# EAGLE design SoundMeter1.1 (EAGLE 7.1.0)
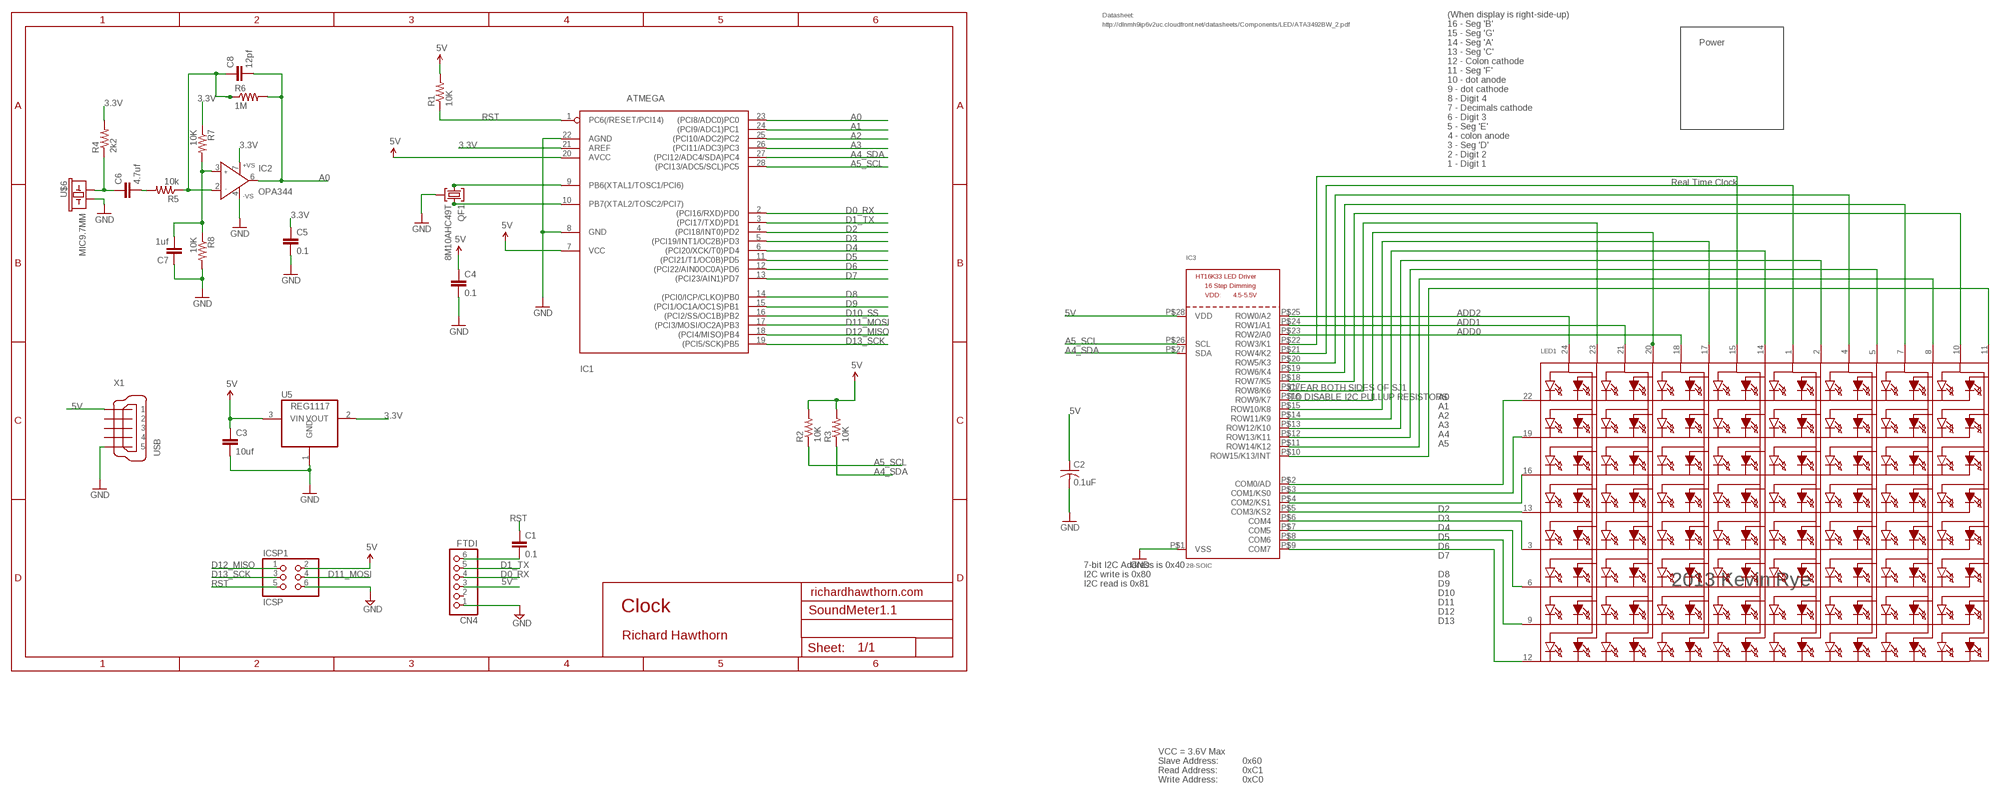
[diagram p0: schematic, sheet 1]

## Parts
C1  0.1  CAPPTH2  [CAP-PTH-SMALL2]
C2  0.1uF  C-US025-025X050  [C025-025X050]
C3  10uf  CAPPTH2  [CAP-PTH-SMALL2]
C4  0.1  CAPPTH2  [CAP-PTH-SMALL2]
C5  0.1  CAPPTH2  [CAP-PTH-SMALL2]
C6  4.7uf  CAPPTH2  [CAP-PTH-SMALL2]
C7  1uf  CAPPTH2  [CAP-PTH-SMALL2]
C8  12pf  CAPPTH2  [CAP-PTH-SMALL2]
CN4  FTDI  PINHD-1X6  [1X06]
IC1  ATMEGA  ATMEGA168PROUND  [DIL28-3-ROUND]
IC2  OPA344  [DIL08]
IC3  28-SOIC  HT16K33_SOP28  [SOP28_300MIL]
ICSP1  ICSP  PINHD-2X3  [2X03]
LED1  DISP_SEGMENT_8X8_BICOLOR_ROWCATHODEMI2A883XX  [SEGMENT_BICOL_BL-M12A883XX]
QF1  8M10AHC49T  [HC49U]
R1  10K  R-US_0204/7  [0204/7]
R2  10K  R-US_0204/7  [0204/7]
R3  10K  R-US_0204/7  [0204/7]
R4  2k2  R-US_0204/7  [0204/7]
R5  10k  R-US_0204/7  [0204/7]
R6  1M  R-US_0204/7  [0204/7]
R7  10K  R-US_0204/7  [0204/7]
R8  10K  R-US_0204/7  [0204/7]
U5  REG1117  [SOT223]
U$6  MIC9.7MM  [MIC-9.7MM]
X1  USB  MINI-USB_SHIELD5P2-32005-601  [32005-601]

## Nets
3.3V: C5.1 IC1.21(AREF) IC2.7(+VS) R4.2 R7.1 U5.2(VOUT)
5V: C2.1 C3.1 C4.1 CN4.3 IC1.7(VCC) IC1.20(AVCC) IC3.P$28(VDD) ICSP1.2 R1.2 R2.2 R3.2 U5.3(VIN) X1.1
A0: C8.2 IC1.23((PCI8/ADC0)PC0) IC2.6(OUT) R6.2
A1: IC1.24((PCI9/ADC1)PC1)
A2: IC1.25((PCI10/ADC2)PC2)
A3: IC1.26((PCI11/ADC3)PC3)
A4_SDA: IC1.27((PCI12/ADC4/SDA)PC4) IC3.P$27(SDA) R3.1
A5_SCL: IC1.28((PCI13/ADC5/SCL)PC5) IC3.P$26(SCL) R2.1
ADD0: IC3.P$23(ROW2/A0) LED1.18(A5)
ADD1: IC3.P$24(ROW1/A1) LED1.21(A3)
ADD2: IC3.P$25(ROW0/A2) LED1.24(A1)
COM: IC3.P$2(COM0/AD) LED1.22(K1)
D0_RX: CN4.4 IC1.2((PCI16/RXD)PD0)
D1_TX: CN4.5 IC1.3((PCI17/TXD)PD1)
D2: IC1.4((PCI18/INT0)PD2)
D3: IC1.5((PCI19/INT1/OC2B)PD3)
D4: IC1.6((PCI20/XCK/T0)PD4)
D5: IC1.11((PCI21/T1/OC0B)PD5)
D6: IC1.12((PCI22/AIN0OC0A)PD6)
D7: IC1.13((PCI23/AIN1)PD7)
D8: IC1.14((PCI0/ICP/CLKO)PB0)
D9: IC1.15((PCI1/OC1A/OC1S)PB1)
D10_SS: IC1.16((PCI2/SS/OC1B)PB2)
D11_MOSI: IC1.17((PCI3/MOSI/OC2A)PB3) ICSP1.4
D12_MISO: IC1.18((PCI4/MISO)PB4) ICSP1.1
D13_SCK: IC1.19((PCI5/SCK)PB5) ICSP1.3
GND [power]: C2.2 C3.2 C4.2 C5.2 C7.1 CN4.1 IC1.8(GND) IC1.22(AGND) IC2.4(-VS) IC3.P$1(VSS) ICSP1.6 QF1.2 R8.2 U5.1(GND) U$6.2 X1.5
N$1: C6.2 R5.2
N$2: IC3.P$9(COM7) LED1.12(K8)
N$3: C8.1 IC2.2(IN-) R5.1 R6.1
N$4: IC3.P$8(COM6) LED1.9(K7)
N$5: C6.1 R4.1 U$6.1
N$6: C7.2 IC2.3(IN+) R7.2 R8.1
N$7: IC3.P$7(COM5) LED1.6(K6)
N$8: IC3.P$6(COM4) LED1.3(K5)
N$9: IC3.P$5(COM3/KS2) LED1.13(K4)
N$10: IC3.P$4(COM2/KS1) LED1.16(K3)
N$11: IC3.P$3(COM1/KS0) LED1.19(K2)
N$14: IC3.P$11(ROW14/K12) LED1.8(A14)
N$15: IC3.P$12(ROW13/K11) LED1.5(A12)
N$16: IC1.9(PB6(XTAL1/TOSC1/PCI6)) QF1.1
N$20: C1.2 CN4.6
N$21: IC3.P$18(ROW7/K5) LED1.10(A15)
N$23: IC3.P$19(ROW6/K4) LED1.7(A13)
N$26: IC1.10(PB7(XTAL2/TOSC2/PCI7)) QF1.3
N$27: IC3.P$21(ROW4/K2) LED1.1(A9)
N$28: IC3.P$22(ROW3/K1) LED1.15(A7)
N$31: IC3.P$10(ROW15/K13/INT) LED1.11(A16)
N$35: IC3.P$20(ROW5/K3) LED1.4(A11)
N$38: IC3.P$17(ROW8/K6) LED1.23(A2)
N$39: IC3.P$16(ROW9/K7) LED1.20(A4)
N$40: IC3.P$14(ROW11/K9) LED1.14(A8)
N$41: IC3.P$15(ROW10/K8) LED1.17(A6)
N$42: IC3.P$13(ROW12/K10) LED1.2(A10)
RST: C1.1 IC1.1(PC6(/RESET/PCI14)) ICSP1.5 R1.1
Unconnected: CN4.2 X1.2 X1.3 X1.4 X1.M1(S1) X1.M2(S2)

## Notes on the sheet
- Datasheet: | (When display is right-side-up)
- http://dlnmh9ip6v2uc.cloudfront.net/datasheets/Components/LED/ATA3492BW_2.pdf | 16 - Seg 'B'
- 15 - Seg 'G'
- 14 - Seg 'A' | Power
- 13 - Seg 'C'
- 12 - Colon cathode
- 11 - Seg 'F'
- 10 - dot anode
- 9 - dot cathode
- 8 - Digit 4
- 7 - Decimals cathode
- 6 - Digit 3
- 5 - Seg 'E'
- 4 - colon anode
- 3 - Seg 'D'
- 2 - Digit 2
- 1 - Digit 1
- Real Time Clock
- CLEAR BOTH SIDES OF SJ1
- TO DISABLE I2C PULLUP RESISTORS | A0
- A1
- A2
- A3
- A4
- A5
- D2
- D3
- D4
- D5
- D6
- D7
- 7-bit I2C Address is 0x40
- I2C write is 0x80 | D8
- I2C read is 0x81 | D9 | 2013 Kevin Rye
- richardhawthorn.com | D10
- D11
- Clock | D12
- D13
- Richard Hawthorn
- VCC = 3.6V Max
- Slave Address: | 0x60
- Read Address: | 0xC1
- Write Address: | 0xC0

## Library data of the parts
C1 C3-C8 = LowPowerLab:CAP: Capacitor Standard 0603 ceramic capacitor, and 0.1" leaded capacitor.
C2 = adafruit:C-US: CAPACITOR, American symbol
CN4 = pinhead:PINHD-1X6: PIN HEADER
IC1 = adafruit:ATMEGA168*P: MICROCONTROLLER 16 kBytes FLASH 1 kBytes SRAM 512 Bytes EEPROM USART 8-channel 10 bit ADC
IC2 = Richards:OPA344: OPA344
IC3 = microbuilder:HT16K33_SOP28
ICSP1 = pinhead:PINHD-2X3: PIN HEADER
LED1 = microbuilder:DISP_SEGMENT_8X8_BICOLOR_ROWCATHODE: 8x8 Bi-Color LED Segment Displays: Row = Cathode 1.2" Bi-Color 8x8 Matrix, 3.0mm Square LEDs - BL-M12A883XX
QF1 = crystal:8M10AHC49T: Monolithic Crystal Filters Source: www.vanlong.com; OC_FARNELL: unknown; OC_NEWARK: unknown
R1-R8 = adafruit:R-US_: RESISTOR, American symbol
U5 = burr-brown:REG1117: 800mA and 1A Low Dropout (LDO) Positive Regulator 1.8V, 2.5V, 2.85V, 3.3V, 5V, and Adj; MPN: REG1117; OC_FARNELL: 1097566; OC_NEWARK: 14P6981
U$6 = SparkFun-Sensors:MIC: Omni-directional electret microphone. 9.7mm standard diameter.; PROD_ID: COMP-08856
X1 = con-cypressindustries:MINI-USB_SHIELD5P2-: MINI USB-B R/A DIP 5pol. Source: www.cypressindustries.com; OC_FARNELL: unknown; OC_NEWARK: unknown

## Net classes
1 power: width 0.381 mm, clearance 0.254 mm

## Board
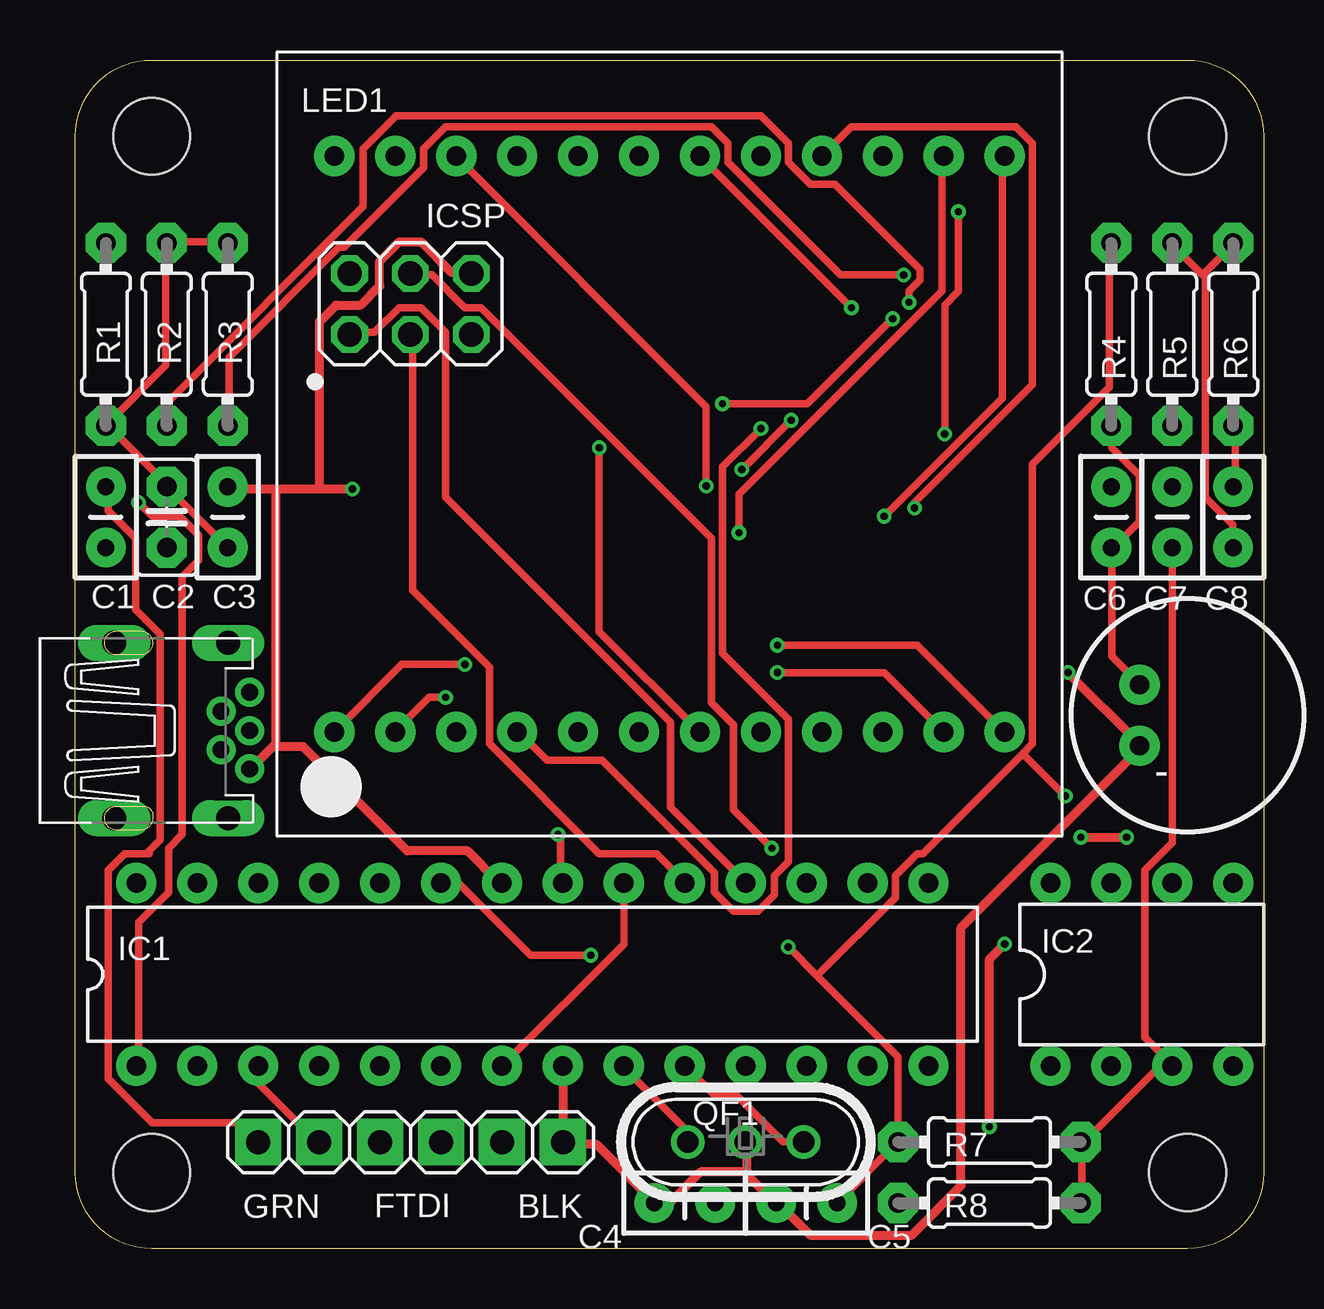
[diagram p1: board, top side]
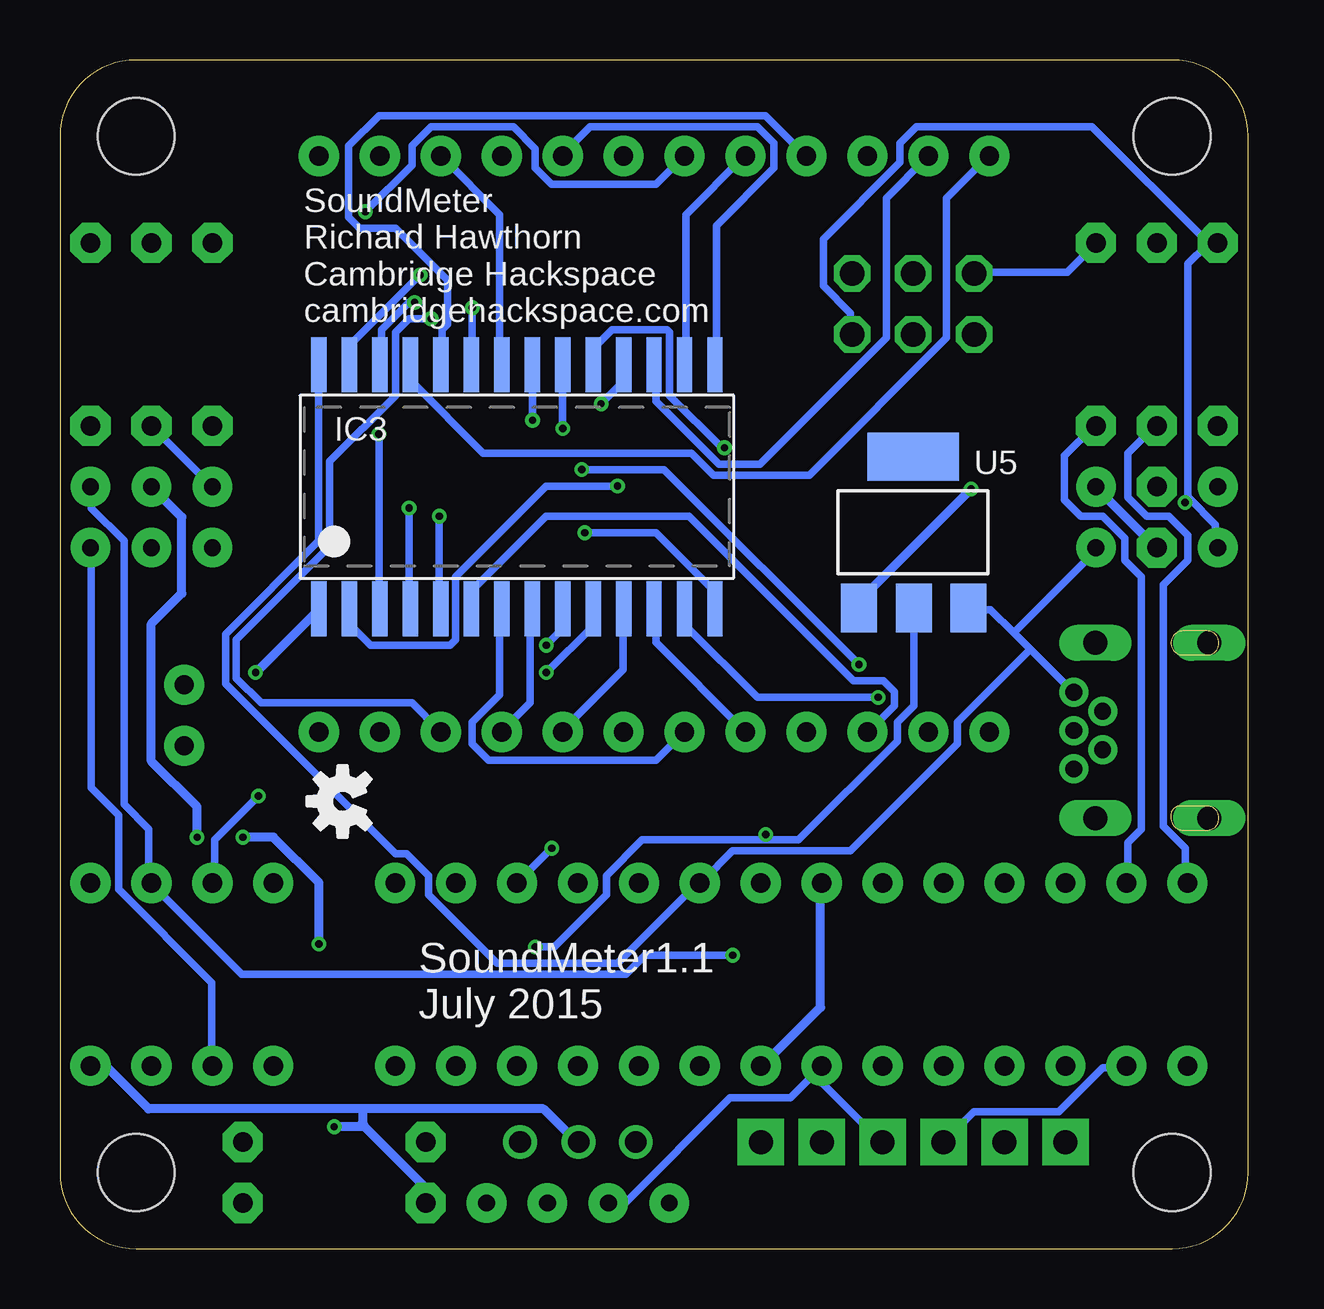
[diagram p2: board, bottom side, seen from below]

Size 49.53 x 49.53 mm. Coordinates in mm from the lower left corner, seen from the top.
Outline: 0,3.17 0,46.35 arc-90 3.17,49.53 46.35,49.53 arc-90 49.53,46.35 49.53,3.17 arc-90 46.35,0 3.17,0 arc-90 0,3.17
Copper layers (1*16): Top 0.035mm / dielectric 1.5mm / Bottom 0.035mm
Design rules "ITEADstudio_DRC *": minimum track width 12mil, minimum drill 12mil, track to track 6mil, track to pad 6mil, pad to pad 6mil, via to via 6mil, smd to smd 0mil, copper to edge 10mil, drill to drill 10mil, minimum pad ring 10mil, minimum via ring 6mil, stop-mask expansion 2mil, vias tented up to drill 100mil, thermal gap 15mil
Holes 3.2 mm at 3.17,3.17 46.35,3.17 3.17,46.35 46.35,46.35
tKeepout: area 0,0 to 5.7,5.7; area 43.8,0 to 49.5,5.7; area 43.8,43.8 to 49.5,49.5; area 0,43.8 to 5.7,49.5
bKeepout: area 0,43.8 to 5.7,49.5; area 43.8,43.8 to 49.5,49.5; area 43.8,0 to 49.5,5.7; area 0,0 to 5.7,5.7
tRestrict: area 24.3,8.9 to 29.1,12.8; area 5.8,16.9 to 6.9,18.5; area 5.2,9.7 to 6.7,10.4
bRestrict: area 27.4,17.7 to 29.2,18.7; area 21.1,13.8 to 22.9,14.9; area 21.6,12.6 to 22.1,13.2; area 20.7,12.6 to 21.2,13.2; area 20.2,12.8 to 20.7,13.5; area 20.1,13.4 to 20.6,14; area 26.5,18.9 to 27.1,19.5; area 26.5,17.9 to 27.1,18.5; area 27.5,19.1 to 28,19.8; area 27.9,18.8 to 29.1,19.6

### Footprints (pad centres in the part's own frame; a part is rotated, then mirrored left to right if it is on the bottom)
CAP-PTH-SMALL2 = drill 0.7 pad 1.651: 1 0,0; 2 2.54,0
C025-025X050 = drill 0.813 pad 1.676 octagon: 1 -1.27,0; 2 1.27,0
1X06 = drill 1 pad 1.93 square: 1 -6.35,0; 2 -3.81,0; 3 -1.27,0; 4 1.27,0; 5 3.81,0; 6 6.35,0
DIL28-3-ROUND = drill 0.813 pad 1.676: 1 -16.51,-3.81; 2 -13.97,-3.81; 3 -11.43,-3.81; 4 -8.89,-3.81; 5 -6.35,-3.81; 6 -3.81,-3.81; 7 -1.27,-3.81; 8 1.27,-3.81; 9 3.81,-3.81; 10 6.35,-3.81; 11 8.89,-3.81; 12 11.43,-3.81; 13 13.97,-3.81; 14 16.51,-3.81; 15 16.51,3.81; 16 13.97,3.81; 17 11.43,3.81; 18 8.89,3.81; 19 6.35,3.81; 20 3.81,3.81; 21 1.27,3.81; 22 -1.27,3.81; 23 -3.81,3.81; 24 -6.35,3.81; 25 -8.89,3.81; 26 -11.43,3.81; 27 -13.97,3.81; 28 -16.51,3.81
DIL08 = drill 0.813 pad 1.676: 1 -3.81,-3.81; 2 -1.27,-3.81; 3 1.27,-3.81; 4 3.81,-3.81; 5 3.81,3.81; 6 1.27,3.81; 7 -1.27,3.81; 8 -3.81,3.81
SOP28_300MIL = smd 0.635 x 2.286: P$1 -8.255,-5.08; P$2 -6.985,-5.08; P$3 -5.715,-5.08; P$4 -4.445,-5.08; P$5 -3.175,-5.08; P$6 -1.905,-5.08; P$7 -0.635,-5.08; P$8 0.635,-5.08; P$9 1.905,-5.08; P$10 3.175,-5.08; P$11 4.445,-5.08; P$12 5.715,-5.08; P$13 6.985,-5.08; P$14 8.255,-5.08; P$15 8.255,5.08; P$16 6.985,5.08; P$17 5.715,5.08; P$18 4.445,5.08; P$19 3.175,5.08; P$20 1.905,5.08; P$21 0.635,5.08; P$22 -0.635,5.08; P$23 -1.905,5.08; P$24 -3.175,5.08; P$25 -4.445,5.08; P$26 -5.715,5.08; P$27 -6.985,5.08; P$28 -8.255,5.08
2X03 = drill 1.016 octagon: 1 -2.54,-1.27; 2 -2.54,1.27; 3 0,-1.27; 4 0,1.27; 5 2.54,-1.27; 6 2.54,1.27
SEGMENT_BICOL_BL-M12A883XX = drill 0.8 pad 1.676: 1 -13.97,-12; 2 -11.43,-12; 3 -8.89,-12; 4 -6.35,-12; 5 -3.81,-12; 6 -1.27,-12; 7 1.27,-12; 8 3.81,-12; 9 6.35,-12; 10 8.89,-12; 11 11.43,-12; 12 13.97,-12; 13 13.97,12; 14 11.43,12; 15 8.89,12; 16 6.35,12; 17 3.81,12; 18 1.27,12; 19 -1.27,12; 20 -3.81,12; 21 -6.35,12; 22 -8.89,12; 23 -11.43,12; 24 -13.97,12
HC49U = drill 0.9: 1 -2.413,0; 2 -0.027,0; 3 2.413,0
0204/7 = drill 0.813 pad 1.676 octagon: 1 -3.81,0; 2 3.81,0
SOT223 = smd 1.499 x 2.007: 1 -2.261,-3.15; 2 0.025,-3.15; 3 2.311,-3.15 | smd 3.81 x 2.007: 4 0,3.15
MIC-9.7MM = drill 0.8 pad 1.676: 1 -2,1.27; 2 -2,-1.27
32005-601 = drill 0.7 pad 1.016: 1 2.825,1.6; 2 1.625,0.8; 3 2.825,0; 4 1.625,-0.8; 5 2.825,-1.6 | drill 1 pad 1.422 long: M1 -2.825,3.65; M2 -2.825,-3.65; M3 1.925,3.65; M4 1.925,-3.65

### Placement (x,y rotation side)
C1  1.27,29.21 90 top
C2  3.81,30.48 270 top
C3  6.35,29.21 90 top
C4  26.67,1.91 180 top
C5  31.75,1.91 180 top
C6  43.18,29.21 90 top
C7  45.72,31.75 270 top
C8  48.26,29.21 90 top
CN4  13.97,4.45 180 top
IC1  19.05,11.43 0 top
IC2  44.45,11.43 0 top
IC3  30.48,31.75 0 bottom
ICSP1  13.97,39.37 0 top
LED1  24.77,33.53 0 top
QF1  27.94,4.45 0 top
R1  1.27,38.1 270 top
R2  3.81,38.1 90 top
R3  6.35,38.1 90 top
R4  43.18,38.1 90 top
R5  45.72,38.1 270 top
R6  48.26,38.1 270 top
R7  38.1,4.45 0 top
R8  38.1,1.91 180 top
U5  13.97,29.84 0 bottom
U$3  [OSHW-LOGO-S]  37.74,18.64 90 bottom
U$6  46.35,22.23 0 top
X1  4.45,21.59 0 top

### Tracks (layer width: path | path; a pad name or v marks a point on that pad's centre or on a via)
3.3V  (via drill 0.3)
  Top 0.305: 30.92,11.37 34.29,8 R7.1 | 30.92,11.37 v29.72,12.57 | R7.1 31.77,1.94 C5.1 | R7.1 | 39.49,20.63 35.32,16.46 35.09,16.46 34.18,15.54 34.18,14.63 30.92,11.37 | 39.49,20.63 39.89,21.03 39.89,32.69 43.09,35.89 43.09,41.83 R4.2 | v20.12,17.26 20.23,17.14 20.23,15.32 IC1.21 | v41.26,18.86 39.49,20.63
  Bottom 0.305: U5.2 13.95,22.63 14.63,21.95 14.63,21.14 18.75,17.03 20.12,17.03 | 20.12,17.03 25.26,17.03 26.75,15.54 26.75,14.74 28.92,12.57 v29.72,12.57 | v20.12,17.26 20.12,17.03 | v41.26,18.86 43.09,17.03 43.09,15.32 IC2.7
5V
  Top 0.305: R3.2 6.29,41.95 3.89,41.95 R2.2 3.77,41.83 3.77,36.8 1.37,34.4 R1.2 1.37,34.29 3.77,31.89 C2.1 3.89,31.66 6.29,29.26 C3.1 | IC1.20 22.86,12.69 17.83,7.66 IC1.7
  Bottom 0.305: ICSP1.2 11.43,40.69 7.54,40.69 6.4,41.83 R3.2 | 9.09,24.98 7.32,23.2 X1.1 | 9.09,24.98 9.77,25.66 | 9.77,25.66 10.74,26.63 11.66,26.63 U5.3 | 9.77,25.66 6.29,29.15 C3.1 | 38.75,36.8 IC3.P$28 38.75,36.69 38.75,29.49 42.63,25.6 42.63,23.55 35.55,16.46 35.09,16.46 34.18,15.54 34.18,14.74 31.32,11.89 26.29,11.89 22.97,15.2 IC1.20 | C4.1 26.63,1.94 25.95,1.94 21.6,6.29 19.09,6.29 17.83,7.54 IC1.7 18.06,7.2 15.32,4.46 CN4.3 | 22.86,15.2 IC1.20 | 9.09,24.98 12.12,21.95 12.12,21.03 16.57,16.57 21.49,16.57 22.75,15.32 IC1.20
A0  (via drill 0.3)
  Top 0.305: C8.2 48.35,31.77 48.35,34.29 R6.2 | v21.49,12.23 18.97,12.23 16,15.2 15.32,15.2 IC1.23
  Bottom 0.305: v21.49,12.23 25.15,12.23 25.95,11.43 41.95,11.43 45.72,15.2 IC2.6 45.83,15.32 45.83,17.49 46.86,18.52 46.86,29.49 48.23,30.86 48.23,31.66 C8.2
A4_SDA  (via drill 0.3)
  Top 0.305: v34.52,40.58 31.89,40.58 27.2,45.26 27.2,46.06 26.52,46.75 15.43,46.75 14.52,45.83 14.52,45.03 11.2,41.72 10.97,41.72 6.4,37.15 6.4,34.29 R3.1
  Bottom 0.305: v34.52,40.58 37.38,37.72 37.38,36.92 IC3.P$27 | IC1.27 5.03,15.32 5.03,16.92 4.46,17.49 4.46,28 5.14,28.69 5.14,29.6 6.06,30.52 6.97,30.52 7.66,31.2 7.66,33.03 6.4,34.29 R3.1
A5_SCL  (via drill 0.3)
  Top 0.305: v34.75,39.43 34.75,39.89 35.2,40.35 35.2,40.8 31.66,44.35 30.63,44.35 29.72,45.26 29.72,46.06 28.57,47.21 13.37,47.21 12,45.83 12,43.43 3.89,35.32 3.89,34.29 R2.1
  Bottom 0.305: v34.75,39.43 34.98,39.43 36.12,38.29 36.12,36.92 IC3.P$26 | IC1.28 2.63,15.32 2.63,16.69 3.54,17.6 3.54,27.66 2.52,28.69 2.52,29.72 3.31,30.52 4.23,30.52 5.03,31.32 5.03,33.15 3.89,34.29 R2.1
ADD0  (via drill 0.3)
  Top 0.305: v32.35,39.2 26.06,45.49 LED1.18
  Bottom 0.305: v32.35,39.2 32.35,36.92 IC3.P$23
ADD1
  Bottom 0.305: IC3.P$24 33.6,36.92 33.6,38.29 33.38,38.52 33.38,40.35 35.55,42.52 37.03,42.52 37.49,42.98 37.49,45.95 36.23,47.21 20.12,47.21 18.52,45.61 LED1.21
ADD2
  Bottom 0.305: IC3.P$25 34.86,36.8 34.86,36.12 31.89,33.15 23.2,33.15 22.29,32.23 18.29,32.23 12.57,37.95 12.57,43.78 10.86,45.49 LED1.24
COM  (via drill 0.3)
  Top 0.305: v26.29,31.77 26.29,35.09 15.89,45.49 LED1.22
  Bottom 0.305: v26.29,31.77 29.26,31.77 33.03,28 33.03,25.38 33.26,25.15 36.58,25.15 37.38,25.95 37.38,26.63 IC3.P$2
D0_RX
  Bottom 0.305: CN4.4 11.43,5.71 7.89,5.71 6.06,7.54 5.14,7.54 IC1.2
D1_TX
  Top 0.305: IC1.3 7.66,7.54 7.66,6.86 10.06,4.46 CN4.5
D11_MOSI  (via drill 0.3)
  Top 0.305: v29.03,16.69 27.43,18.29 27.43,21.83 26.52,22.75 26.52,29.6 16.92,39.2 16.23,39.2 14.86,40.58 14.06,40.58 ICSP1.4
  Bottom 0.305: IC1.17 v29.03,16.69
D12_MISO
  Top 0.305: ICSP1.1 11.43,38.18 12.46,38.18 13.49,39.2 14.4,39.2 15.43,38.18 15.43,31.32 24.8,21.95 24.8,18.4 27.89,15.32 IC1.18
D13_SCK
  Top 0.305: ICSP1.3 14.06,38.06 14.06,27.43 17.26,24.23 17.26,21.03 21.83,16.46 24.23,16.46 25.38,15.32 IC1.19
GND  (via drill 0.3)
  Top 0.381: 8.34,31.66 6.4,31.66 C3.2 | 8.34,31.66 10.17,31.66 | 10.17,31.66 v11.54,31.66 | 8.34,21.03 7.32,20 X1.5 | 8.34,31.66 8.34,21.03 | 10.17,31.66 10.17,38.63 10.86,39.32 11.89,39.32 12.69,40.12 12.69,41.15 13.49,41.95 14.4,41.95 15.66,40.69 16.46,40.69 ICSP1.6 | 17.83,15.32 IC1.22 17.6,15.32 16.34,16.57 13.83,16.57 9.49,20.92 8.46,20.92 8.34,21.03 | IC1.8 20.34,7.54 20.34,4.46 CN4.1 20.46,4.34 21.72,4.34 24,2.06 C4.2 24.23,1.94 24.8,1.94 26.06,3.2 28,3.2 | v41.38,24 44.35,21.03 U$6.2 44.35,20.8 36.92,13.37 36.92,2.63 34.86,0.57 30.63,0.57 29.38,1.83 C5.2 29.15,1.94 28,3.09 28,3.2 | 28,3.2 28,4.34 QF1.2 | v41.91,17.14 v43.81,17.14 | v38.73,12.7 38.1,12.06 v38.1,5.08
  Bottom 0.381: U5.1 16.23,26.98 v11.54,31.66 | C2.2 3.89,29.26 6.29,31.66 C3.2 | 20.23,7.66 IC1.8 20.12,7.77 17.83,10.06 17.83,15.2 IC1.22 | v41.38,24 38.75,26.63 IC3.P$1 | 36.92,5.83 29.38,5.83 28,4.46 QF1.2 | 36.92,5.83 45.83,5.83 47.55,7.54 48.23,7.54 IC2.4 | C7.1 44.45,30.48 44.45,27.3 45.72,26.04 45.72,20.32 43.81,18.41 v43.81,17.14 | v41.91,17.14 40.64,17.14 38.73,15.24 v38.73,12.7 | 36.83,5.08 v38.1,5.08 | 36.83,5.08 34.29,2.54 R8.2 | 36.92,5.83 36.92,5.26 36.83,5.08
N$1
  Bottom 0.305: R5.2 C6.2
N$2  (via drill 0.3)
  Top 0.305: v29.26,25.15 35.09,25.15 38.63,21.6 LED1.12
  Bottom 0.305: IC3.P$9 28.57,25.83 v29.26,25.15
N$3
  Top 0.305: 47.09,40.58 47.09,40.69 48.23,41.83 R6.1 | 47.09,40.58 47.09,31.32 48.23,30.18 48.23,29.26 C8.1 | 47.09,40.58 46.98,40.58 45.72,41.83 R5.1
  Bottom 0.305: C8.1 48.23,29.15 48.23,19.2 47.09,18.06 47.09,14.97 43.2,11.09 43.2,7.66 IC2.2
N$4
  Bottom 0.305: IC3.P$8 29.95,26.63 29.95,22.75 31.09,21.6 LED1.9
N$5
  Top 0.305: U$6.1 44.35,23.55 43.2,24.69 43.2,29.15 C6.1 43.32,29.26 44.35,30.29 44.35,32.23 43.2,33.38 43.2,34.29 R4.1
N$6
  Top 0.305: R8.1 41.95,1.94 41.95,4.34 R7.2 42.06,4.46 45.49,7.89 | C7.2 45.72,16.92 44.58,15.77 44.58,8.8 45.49,7.89 | 45.49,7.89 45.72,7.66 IC2.3 45.49,7.89
N$7
  Bottom 0.305: IC3.P$7 31.2,26.63 31.2,23.09 32.35,21.95 32.35,21.03 31.66,20.34 24.69,20.34 23.55,21.49 LED1.6
N$8
  Bottom 0.305: IC3.P$6 32.35,26.75 32.35,27.43 29.26,30.52 23.32,30.52 16.46,23.66 15.2,23.66 14.74,23.2 14.74,22.63 15.77,21.6 LED1.3
N$9  (via drill 0.3)
  Top 0.305: v33.72,30.52 38.63,35.43 38.63,45.49 LED1.13
  Bottom 0.305: v33.72,30.52 33.72,26.75 IC3.P$5
N$10  (via drill 0.3)
  Top 0.305: v34.98,30.86 34.98,31.09 39.89,36.01 39.89,46.06 39.2,46.75 32.35,46.75 31.2,45.61 LED1.16
  Bottom 0.305: v34.98,30.86 34.98,26.75 IC3.P$4
N$11  (via drill 0.3)
  Top 0.305: v36.23,33.95 36.23,39.32 36.8,39.89 v36.8,43.2
  Bottom 0.305: v36.23,33.95 36.23,26.75 IC3.P$3 | v36.8,43.2 34.86,45.15 34.86,45.95 34.06,46.75 30.63,46.75 29.72,45.83 29.72,45.03 29.03,44.35 24.69,44.35 23.55,45.49 LED1.19
N$14
  Bottom 0.305: IC3.P$11 26.06,26.63 26.06,24.12 28.57,21.6 LED1.8
N$15
  Bottom 0.305: IC3.P$12 24.69,26.63 24.69,25.26 21.03,21.6 LED1.5
N$16
  Top 0.305: QF1.1 25.49,4.46 25.49,4.92 22.86,7.54 IC1.9
N$20
  Top 0.305: C1.2 1.37,31.66 1.37,30.75 2.52,29.6 2.52,26.63 3.54,25.6 3.54,17.03 3.09,16.57 3.09,16.46 2.06,16.46 1.37,15.77 1.37,7.09 3.2,5.26 6.74,5.26 7.54,4.46 CN4.6
N$21  (via drill 0.3)
  Top 0.305: v26.98,35.2 30.52,35.2 v34.06,38.75
  Bottom 0.305: v26.98,35.2 26.06,36.12 26.06,36.8 IC3.P$18 | v34.06,38.75 34.98,38.75 35.55,38.18 35.55,35.55 38.29,32.8 38.29,29.26 42.18,25.38 42.18,23.77 41.15,22.75 34.86,22.75 33.72,21.6 LED1.10
N$23  (via drill 0.3)
  Top 0.305: v21.83,33.38 21.83,25.72 25.95,21.6 LED1.7
  Bottom 0.305: v21.83,33.38 21.95,33.38 24.12,35.55 24.12,38.18 24.23,38.29 26.52,38.29 27.2,37.6 27.2,36.92 IC3.P$19
N$26
  Top 0.305: QF1.3 30.29,4.46 29.49,4.46 27.55,6.4 26.63,6.4 25.49,7.54 IC1.10
N$27  (via drill 0.3)
  Top 0.305: v27.77,32.46 v29.83,34.52 | v16.23,24.35 13.6,24.35 10.86,21.6 LED1.1
  Bottom 0.305: v29.83,34.52 29.83,36.8 IC3.P$21 | v27.77,32.46 24.35,32.46 v16.23,24.35
N$28
  Bottom 0.305: IC3.P$22 31.2,36.92 31.2,43.09 33.6,45.49 LED1.15
N$31  (via drill 0.3)
  Top 0.305: v29.26,24 33.72,24 36.12,21.6 LED1.11
  Bottom 0.305: v29.26,24 27.32,25.95 27.32,26.63 IC3.P$10
N$35  (via drill 0.3)
  Top 0.305: v28.57,34.18 26.98,32.58 26.98,24.8 29.72,22.06 29.72,16.12 29.15,15.54 29.15,14.74 28.46,14.06 27.43,14.06 26.63,14.86 26.63,15.66 21.95,20.34 19.66,20.34 18.52,21.49 LED1.4
  Bottom 0.305: v28.57,34.18 IC3.P$20
N$38
  Bottom 0.305: IC3.P$17 24.69,36.8 24.69,35.32 22.06,32.69 20.34,32.69 15.09,37.95 15.09,43.78 13.37,45.49 LED1.23
N$39
  Bottom 0.305: IC3.P$16 23.43,36.92 23.43,43.09 21.03,45.49 LED1.20
N$40  (via drill 0.3)
  Top 0.305: v27.66,29.83 27.66,31.43 36.12,39.89 36.12,45.49 LED1.14
  Bottom 0.305: v27.66,29.83 24.69,29.83 22.29,27.43 22.29,26.75 IC3.P$14
N$41
  Bottom 0.305: IC3.P$15 22.17,36.92 22.17,42.63 19.77,45.03 19.77,46.06 20.46,46.75 27.43,46.75 28.57,45.61 LED1.17
N$42  (via drill 0.3)
  Top 0.305: v15.43,22.97 14.74,22.97 13.37,21.6 LED1.2
  Bottom 0.305: v15.43,22.97 20.46,22.97 23.43,25.95 23.43,26.63 IC3.P$13
RST  (via drill 0.3)
  Top 0.305: v2.63,31.09 3.2,30.52 4.34,30.52 5.14,29.72 5.14,28.69 4.46,28 4.46,17.26 3.89,16.69 3.89,14.86 2.63,13.6 2.63,7.66 IC1.1
  Bottom 0.305: ICSP1.5 16.57,38.18 16.57,38.98 17.72,40.12 17.72,42.06 14.52,45.26 14.52,46.06 13.83,46.75 6.51,46.75 1.71,41.95 1.37,41.95 R1.1 1.71,41.83 2.52,41.03 2.52,31.32 2.46,31.26 | 2.46,31.26 1.37,30.18 1.37,29.26 C1.1 | 2.46,31.26 v2.63,31.09

### Text on the board
tNames: GRN | FTDI | BLK
bNames: SoundMeter / Richard Hawthorn / Cambridge Hackspace / cambridgehackspace.com | SoundMeter1.1 / July 2015
tDocu: REG